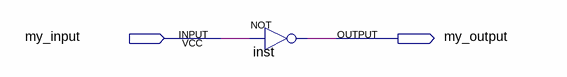
[diagram p0: schematic sheet]
// Quartus schematic MY_NOT.bdf as structural Verilog: 1 symbols, 2 pins
module MY_NOT (
  input  my_input,
  output my_output
);

  not inst (my_output, my_input);
endmodule
